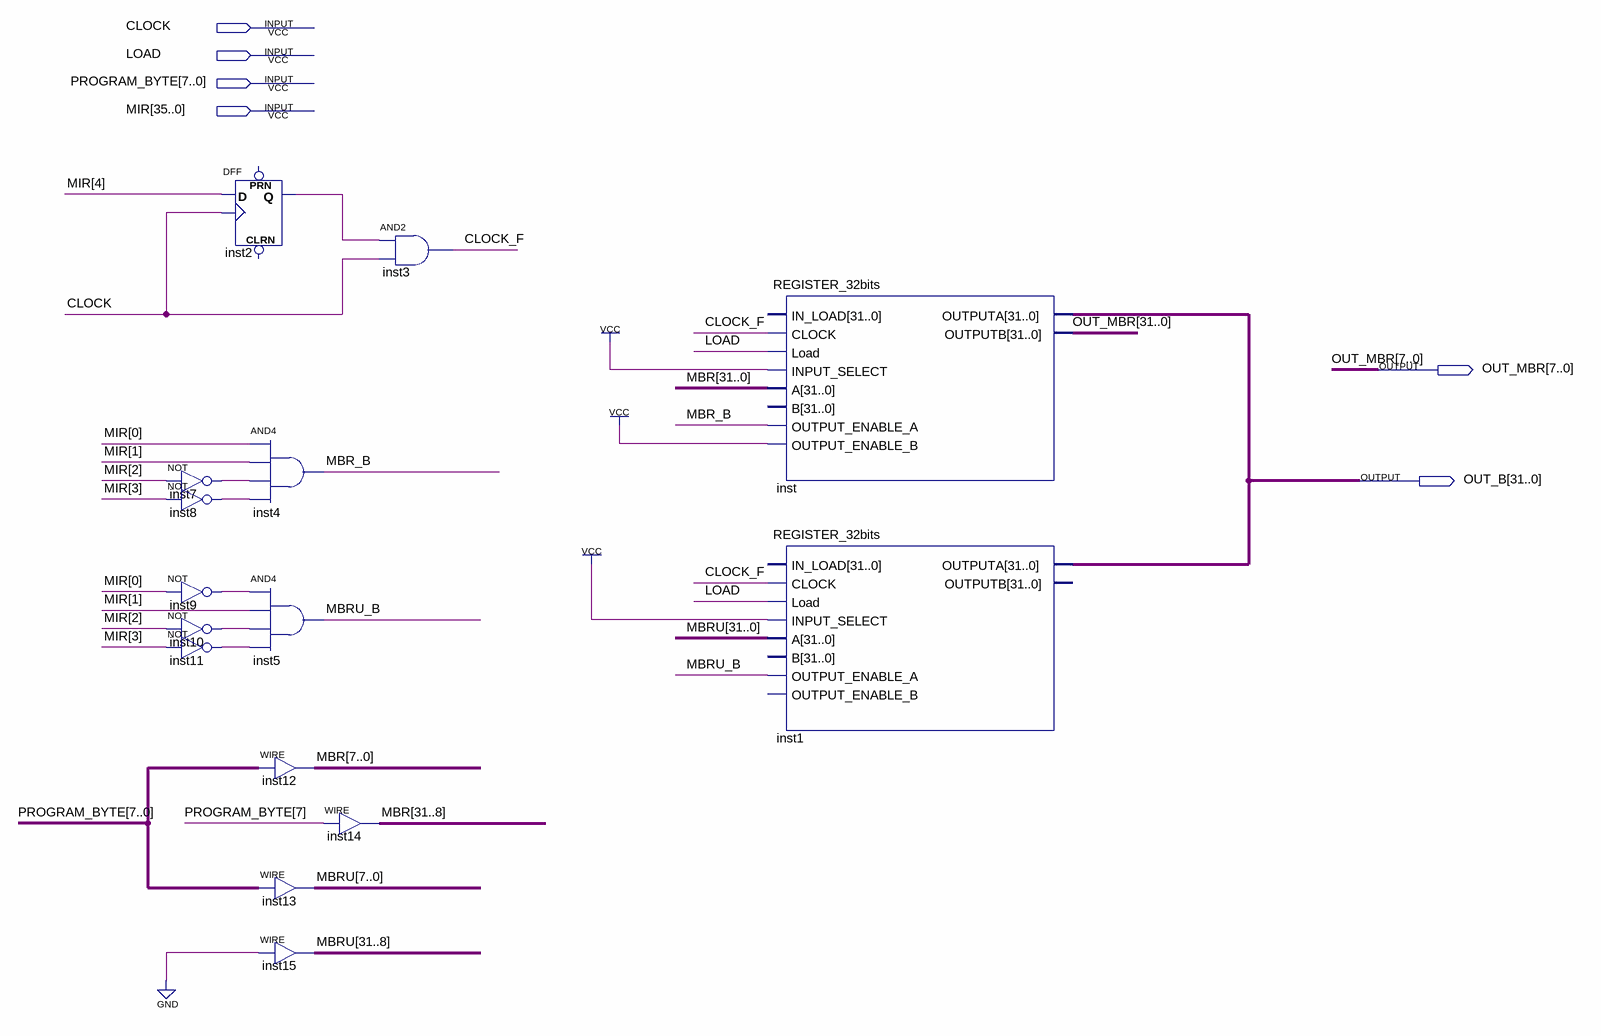
[diagram p0: schematic sheet]
// Quartus schematic MBR.bdf as structural Verilog: 15 symbols, 6 pins
module MBR (
  input  CLOCK,
  input  LOAD,
  input  [7:0] PROGRAM_BYTE,
  input  [35:0] MIR,
  output [31:0] OUT_MBR,
  output [31:0] OUT_B
);

  wire CLOCK_F, inst2_q, inst7_out, inst8_out, inst9_out, inst10_out, inst11_out, MBR_B, MBRU_B;
  wire [31:0] MBR, MBRU;

  not inst7 (inst7_out, MIR[2]);
  not inst8 (inst8_out, MIR[3]);
  not inst9 (inst9_out, MIR[0]);
  not inst10 (inst10_out, MIR[2]);
  not inst11 (inst11_out, MIR[3]);
  DFF inst2 (.CLK(CLOCK), .D(MIR[4]), .Q(inst2_q));  // open: CLRN, PRN
  and inst4 (MBR_B, MIR[0], MIR[1], inst7_out, inst8_out);
  and inst5 (MBRU_B, inst9_out, MIR[1], inst10_out, inst11_out);
  assign MBR[7:0] = PROGRAM_BYTE;  // WIRE inst12
  assign MBR[31:8] = {24{PROGRAM_BYTE[7]}};  // WIRE inst14
  assign MBRU[7:0] = PROGRAM_BYTE;  // WIRE inst13
  assign MBRU[31:8] = {24{1'b0}};  // WIRE inst15
  and inst3 (CLOCK_F, inst2_q, CLOCK);
  REGISTER_32bits inst (
    .CLOCK(CLOCK_F), .Load(LOAD), .INPUT_SELECT(1'b1), .A(MBR), .OUTPUT_ENABLE_A(MBR_B),
    .OUTPUT_ENABLE_B(1'b1), .OUTPUTA(OUT_B), .OUTPUTB(OUT_MBR));  // open: IN_LOAD, B
  REGISTER_32bits inst1 (
    .CLOCK(CLOCK_F), .Load(LOAD), .INPUT_SELECT(1'b1), .A(MBRU), .OUTPUT_ENABLE_A(MBRU_B), .OUTPUTA(OUT_B));  // open: IN_LOAD, B, OUTPUT_ENABLE_B, OUTPUTB
endmodule
